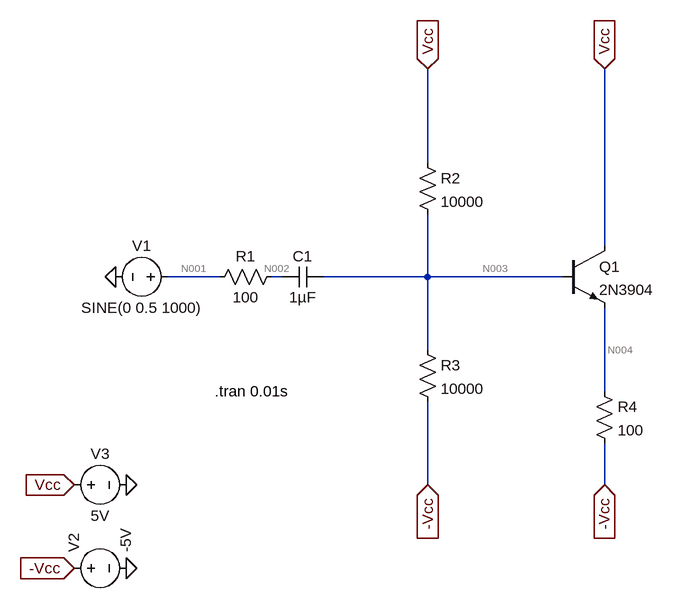
[diagram p0: schematic BJTamplifier.asc]
BJTamplifier.asc, the LTspice schematic file:
Version 4.1
SHEET 1 1176 680
WIRE 560 -16 560 -160
WIRE 832 112 832 -160
WIRE 240 160 160 160
WIRE 336 160 320 160
WIRE 560 160 560 64
WIRE 560 160 400 160
WIRE 768 160 560 160
WIRE 560 272 560 160
WIRE 832 336 832 208
WIRE 560 480 560 352
WIRE 832 480 832 416
FLAG 80 160 0
FLAG 96 608 0
FLAG 96 480 0
FLAG 16 480 Vcc
IOPIN 16 480 In
FLAG 560 -160 Vcc
IOPIN 560 -160 In
FLAG 832 -160 Vcc
IOPIN 832 -160 In
FLAG 16 608 -Vcc
IOPIN 16 608 In
FLAG 832 480 -Vcc
IOPIN 832 480 In
FLAG 560 480 -Vcc
IOPIN 560 480 In
SYMBOL voltage 176 160 R90
WINDOW 0 -32 56 VBottom 2
WINDOW 3 32 56 VTop 2
WINDOW 123 0 0 Left 0
WINDOW 39 0 0 Left 0
SYMATTR InstName V1
SYMATTR Value SINE(0 0.5 1000)
SYMBOL res 336 144 R90
WINDOW 0 0 56 VBottom 2
WINDOW 3 32 56 VTop 2
SYMATTR InstName R1
SYMATTR Value 100
SYMBOL cap 400 144 R90
WINDOW 0 0 32 VBottom 2
WINDOW 3 32 32 VTop 2
SYMATTR InstName C1
SYMATTR Value 1µF
SYMBOL res 544 -32 R0
SYMATTR InstName R2
SYMATTR Value 10000
SYMBOL res 544 256 R0
SYMATTR InstName R3
SYMATTR Value 10000
SYMBOL npn 768 112 R0
SYMATTR InstName Q1
SYMATTR Value 2N3904
SYMBOL res 816 320 R0
SYMATTR InstName R4
SYMATTR Value 100
SYMBOL voltage 0 608 R270
WINDOW 123 0 0 Left 0
WINDOW 39 0 0 Left 0
SYMATTR InstName V2
SYMATTR Value -5V
SYMBOL voltage 0 480 R270
WINDOW 0 32 56 VTop 2
WINDOW 3 -32 56 VBottom 2
SYMATTR InstName V3
SYMATTR Value 5V
TEXT 232 336 Left 2 !.tran 0.01s

The netlist it stands for:
* BJTamplifier.asc
V1 N001 0 SINE(0 0.5 1000)
R1 N002 N001 100
C1 N003 N002 1µF
R2 Vcc N003 10000
R3 N003 -Vcc 10000
Q1 Vcc N003 N004 0 2N3904
R4 N004 -Vcc 100
V2 -Vcc 0 -5V
V3 Vcc 0 5V
.model NPN NPN
.model PNP PNP
.lib standard.bjt
.tran 0.01s
.backanno
.end

* Results of the author's LTspice run, read from the files saved beside the schematic
* Operating Point, zero values left out:
*   V(-vcc) = -5 V
*   V(n003) = -619.1 mV
*   V(n004) = -1.374 V
*   V(vcc) = 5 V
*   I(R2) = 561.9 µA
*   I(R3) = 438.1 µA
*   I(R4) = 36.26 mA
*   I(V2) = 36.7 mA
*   I(V3) = -36.7 mA
*   Ib(Q1) = 123.8 µA
*   Ic(Q1) = 36.14 mA
*   Ie(Q1) = -36.26 mA
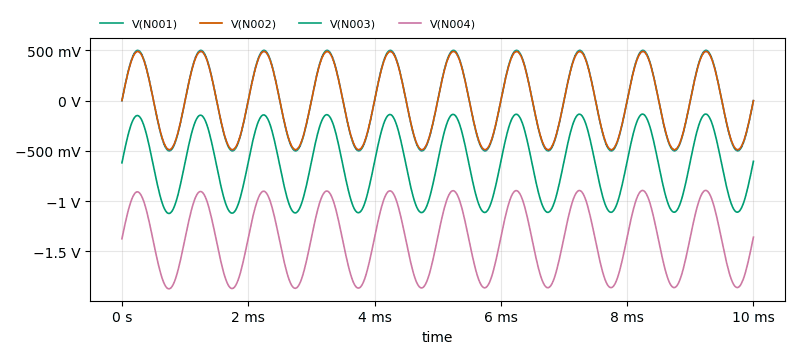
[diagram p1: Transient Analysis of BJTamplifier.asc, plotted from the saved traces]
* Transient Analysis, 1 run:
*   V(N001): min -500 mV, max 500 mV, average 99.18 µV, rms 353.7 mV, last 0 V
*   V(N002): min -488.4 mV, max 488.7 mV, average 258 µV, rms 345.5 mV, last -375.8 µV
*   V(N003): min -1.122 V, max -133.7 mV, average -626.3 mV, rms 715 mV, last -603.3 mV
*   V(N004): min -1.871 V, max -892.9 mV, average -1.381 V, rms 1.422 V, last -1.358 V